# Altium schematic sheet BiasVoltage.SchDoc: Bias Voltage
size A; DocumentNumber: 15; SheetNumber: 15; SheetTotal: 22
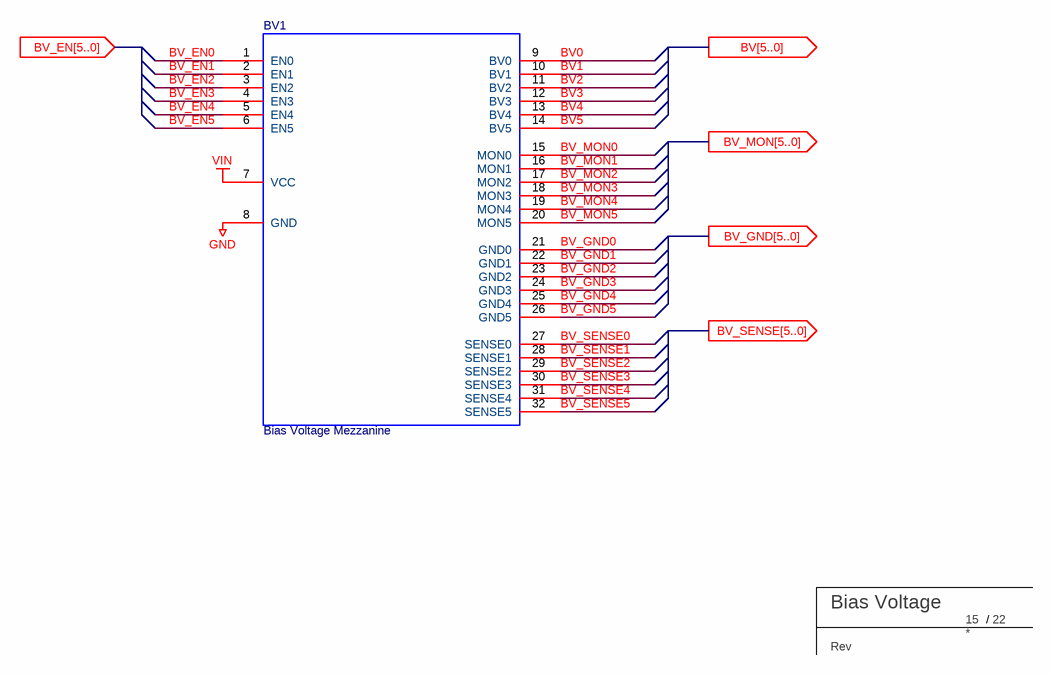
[diagram p0: BiasVoltage.SchDoc]

## Parts
BV1  Bias Voltage Mezzanine  [wp7b-40p]
TBLOCK?  BU Title block  (value not drawn)  (graphical)

## Ports
BV[5..0] (out), BV_EN[5..0] (in), BV_GND[5..0] (out), BV_MON[5..0] (out), BV_SENSE[5..0] (out)

## Nets
GND: BV1.8(GND)
VIN: BV1.7(VCC)
BV0: BV1.9(BV0)
BV1: BV1.10(BV1)
BV2: BV1.11(BV2)
BV3: BV1.12(BV3)
BV4: BV1.13(BV4)
BV5: BV1.14(BV5)
BV_EN0: BV1.1(EN0)
BV_EN1: BV1.2(EN1)
BV_EN2: BV1.3(EN2)
BV_EN3: BV1.4(EN3)
BV_EN4: BV1.5(EN4)
BV_EN5: BV1.6(EN5)
BV_GND0: BV1.21(GND0)
BV_GND1: BV1.22(GND1)
BV_GND2: BV1.23(GND2)
BV_GND3: BV1.24(GND3)
BV_GND4: BV1.25(GND4)
BV_GND5: BV1.26(GND5)
BV_MON0: BV1.15(MON0)
BV_MON1: BV1.16(MON1)
BV_MON2: BV1.17(MON2)
BV_MON3: BV1.18(MON3)
BV_MON4: BV1.19(MON4)
BV_MON5: BV1.20(MON5)
BV_SENSE0: BV1.27(SENSE0)
BV_SENSE1: BV1.28(SENSE1)
BV_SENSE2: BV1.29(SENSE2)
BV_SENSE3: BV1.30(SENSE3)
BV_SENSE4: BV1.31(SENSE4)
BV_SENSE5: BV1.32(SENSE5)

## Notes on the sheet
- (in symbol TITLE_BLOCK_BU) /; Rev

## Library data of the parts
BV1 = BV_MEZZ
TBLOCK? = TITLE_BLOCK_BU